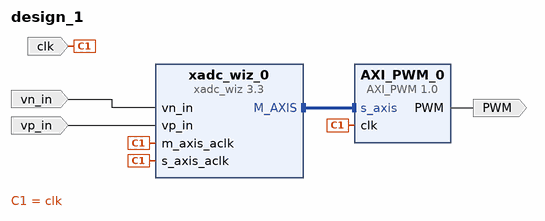
[diagram p0: block diagram of the top level]
# Vivado block design design_1, Vivado 2016.2
create_bd_design design_1

create_bd_port -dir O PWM
create_bd_port -dir I vn_in
create_bd_port -dir I vp_in
create_bd_port -dir I -type clk clk

create_bd_cell -type ip -vlnv xilinx.com:ip:xadc_wiz:3.3 xadc_wiz_0
set_property -dict [list \
  CONFIG.INTERFACE_SELECTION ENABLE_DRP \
  CONFIG.ENABLE_RESET true \
  CONFIG.ENABLE_AXI4STREAM true \
] [get_bd_cells xadc_wiz_0]
create_bd_cell -type ip -vlnv user.org:user:AXI_PWM:1.0 AXI_PWM_0

# ---- connections ----

connect_bd_intf_net [get_bd_intf_pins xadc_wiz_0/M_AXIS] [get_bd_intf_pins AXI_PWM_0/s_axis]
connect_bd_net [get_bd_pins AXI_PWM_0/PWM] [get_bd_ports PWM]
connect_bd_net [get_bd_ports vn_in] [get_bd_pins xadc_wiz_0/vn_in]
connect_bd_net [get_bd_ports vp_in] [get_bd_pins xadc_wiz_0/vp_in]
connect_bd_net [get_bd_ports clk] [get_bd_pins xadc_wiz_0/m_axis_aclk] [get_bd_pins xadc_wiz_0/s_axis_aclk] [get_bd_pins AXI_PWM_0/clk]

validate_bd_design
save_bd_design
